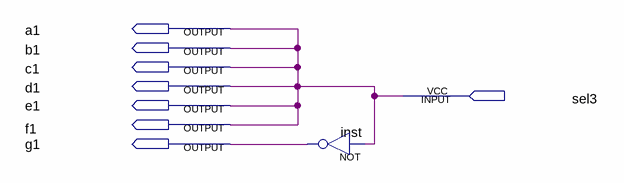
[diagram p0: schematic sheet]
// Quartus schematic simb_negativo.bdf as structural Verilog: 1 symbols, 8 pins
module simb_negativo (
  input  sel3,
  output a1,
  output b1,
  output c1,
  output d1,
  output e1,
  output f1,
  output g1
);

  not inst (g1, sel3);

  assign a1 = sel3;
  assign b1 = sel3;
  assign c1 = sel3;
  assign d1 = sel3;
  assign e1 = sel3;
  assign f1 = sel3;
endmodule
